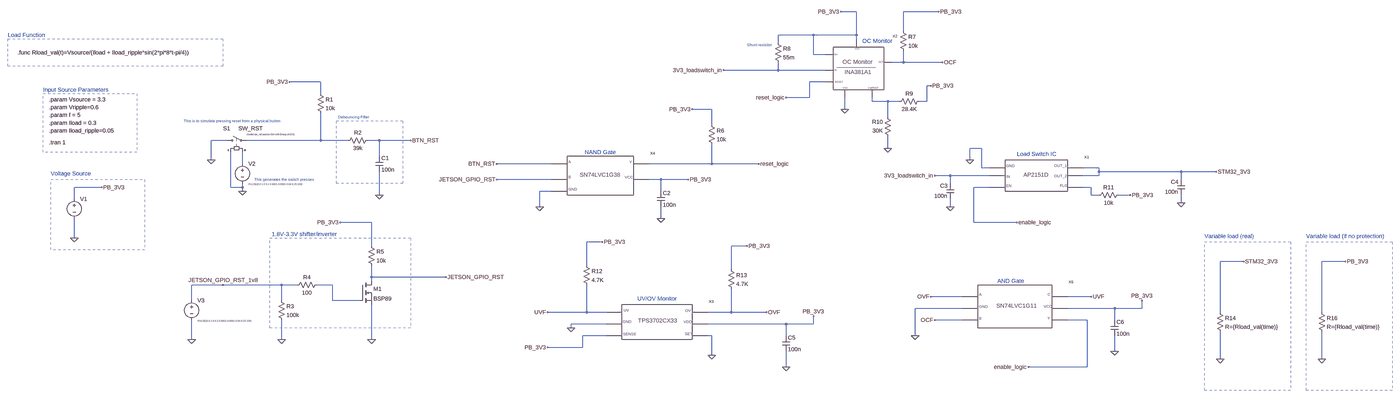
[diagram p0: schematic STM32_PM_Sim.asc, whole sheet]
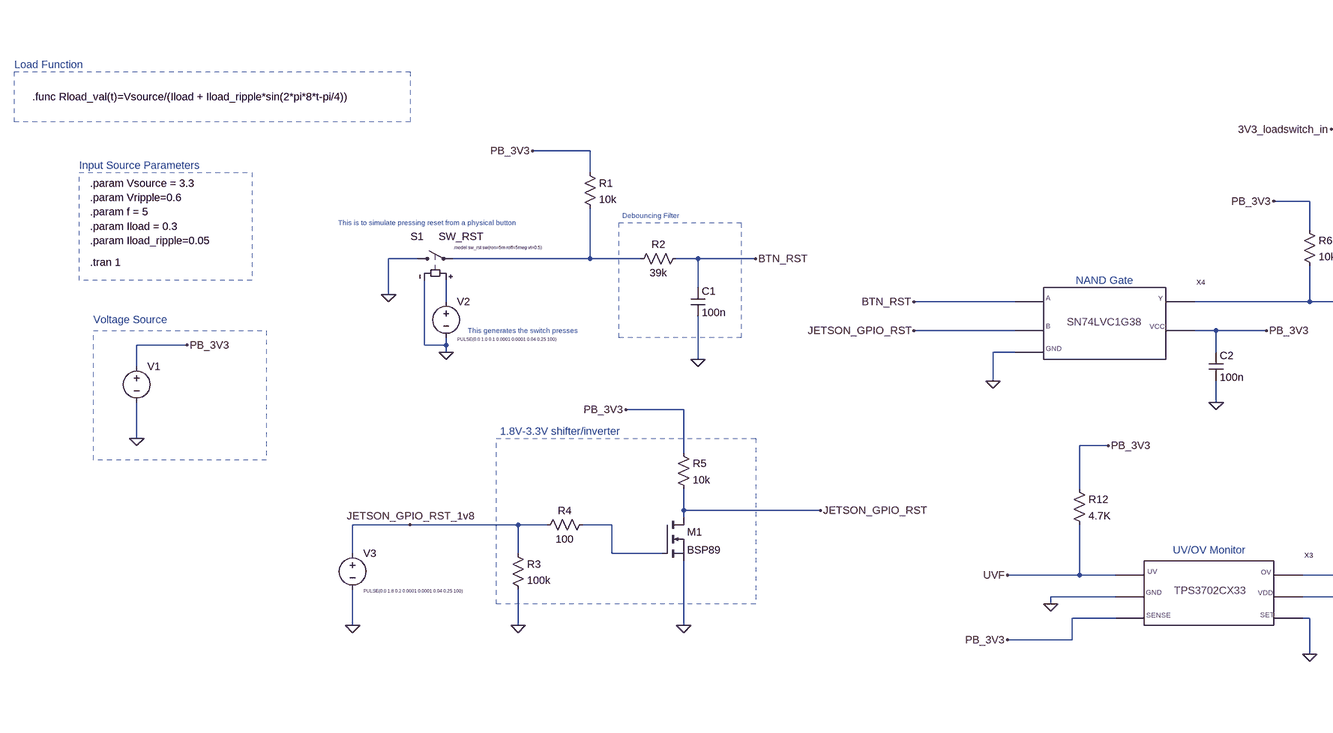
[diagram p1: schematic STM32_PM_Sim.asc, part, row 1 of 1, column 1 of 2]
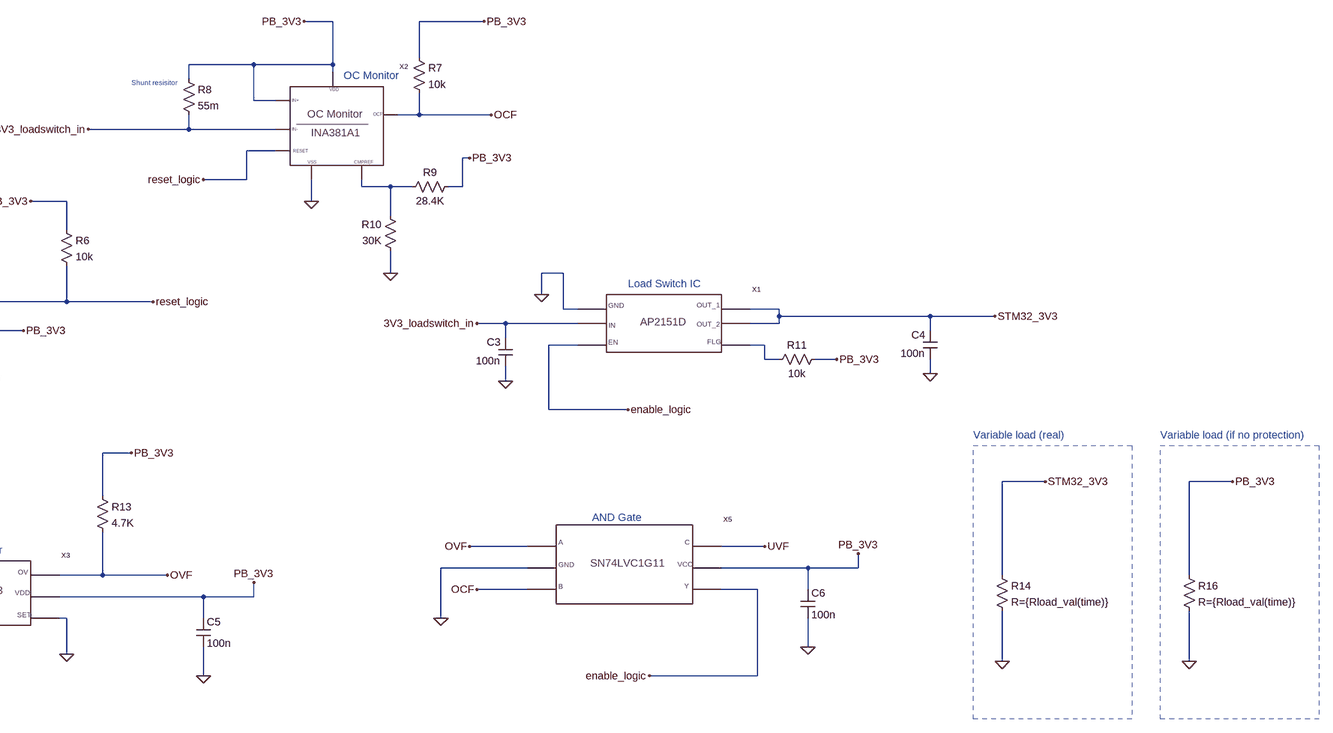
[diagram p2: schematic STM32_PM_Sim.asc, part, row 1 of 1, column 2 of 2]
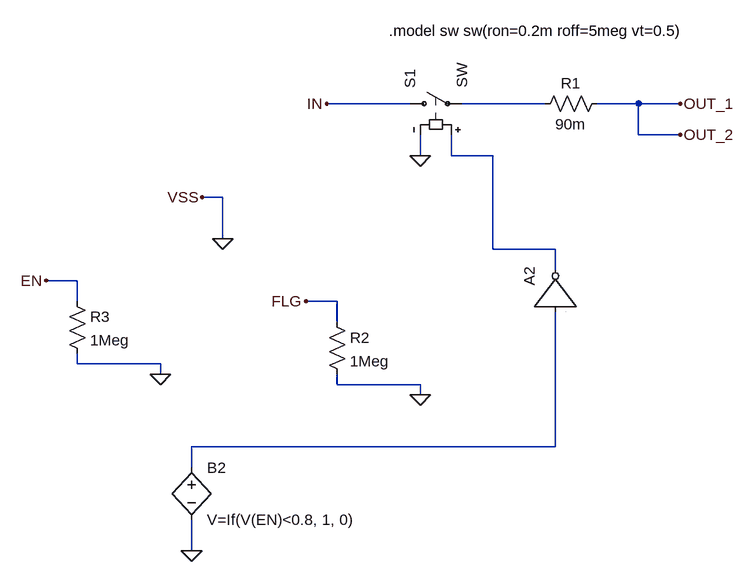
[diagram p3: sub-circuit ap2151d.asc]
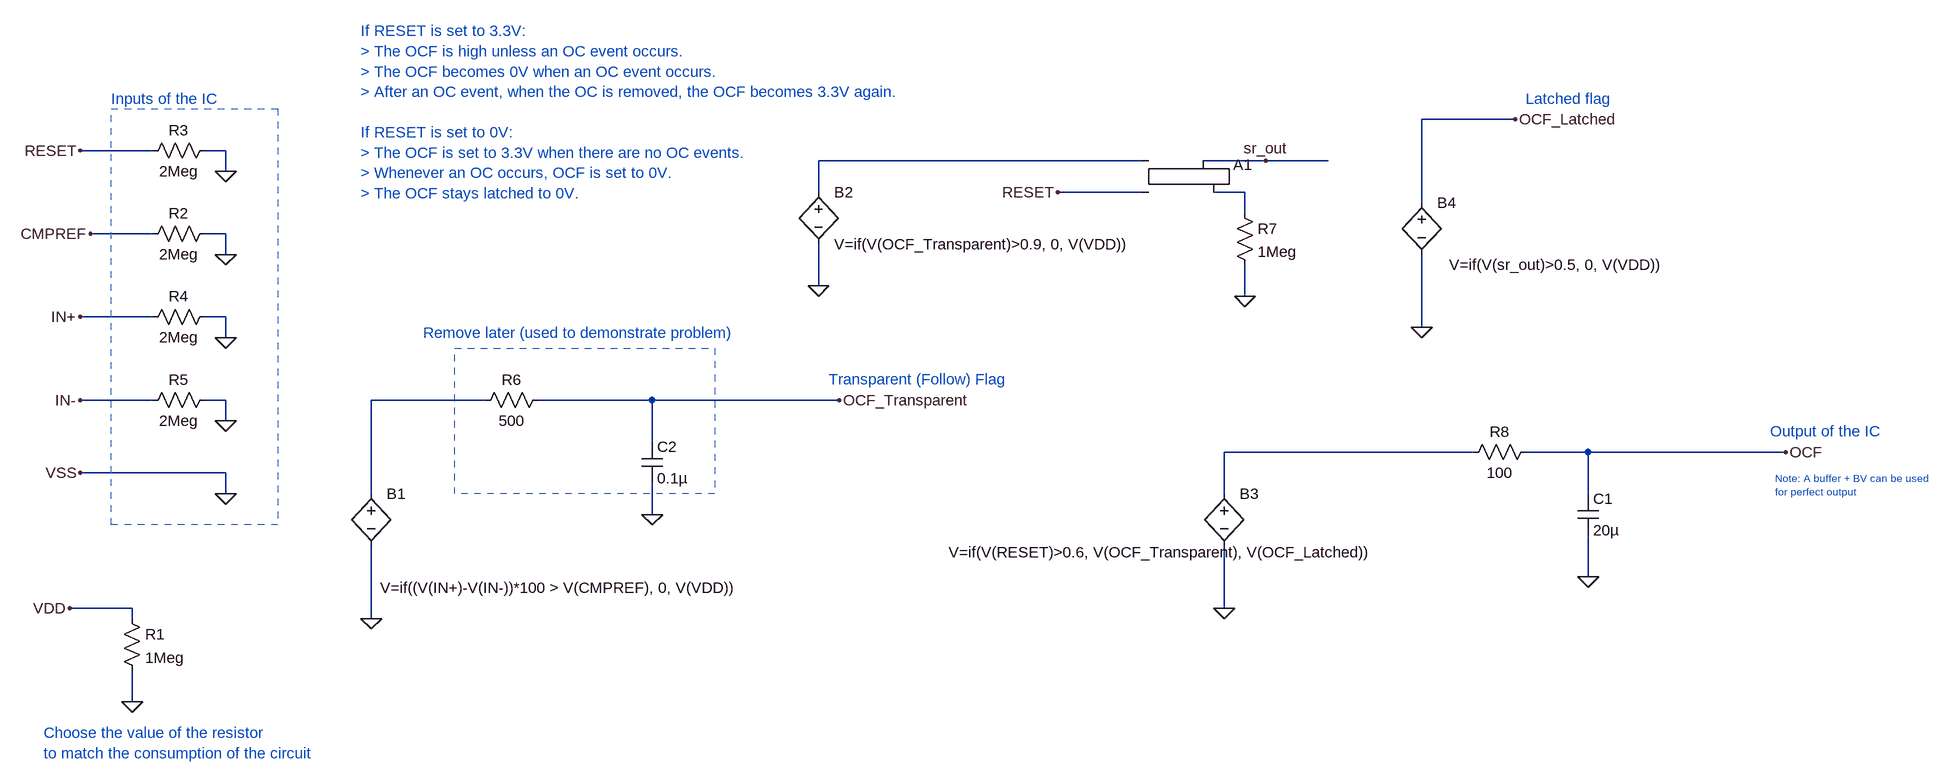
[diagram p4: sub-circuit ina381a1.asc]
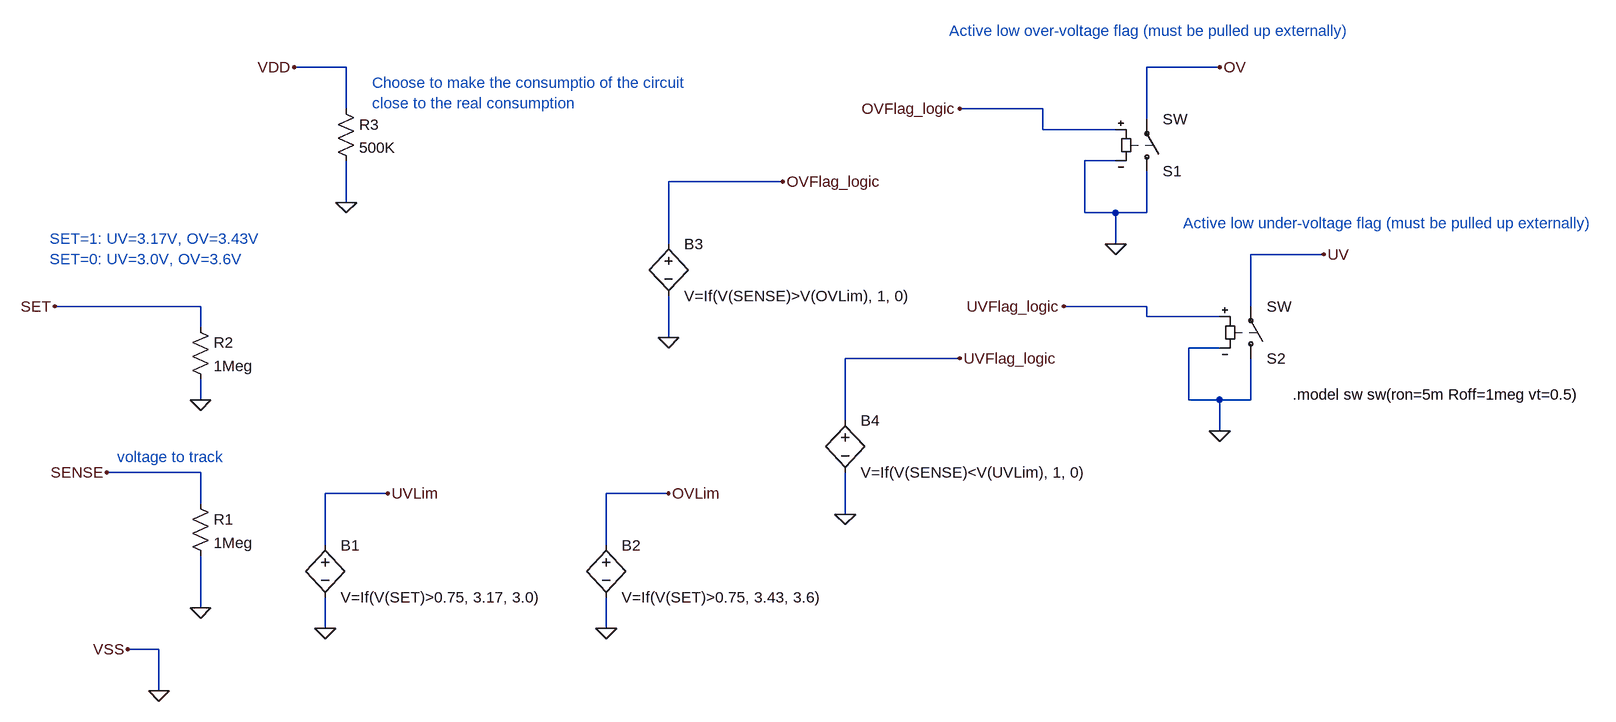
[diagram p5: sub-circuit tps3702cx33ddcr.asc]
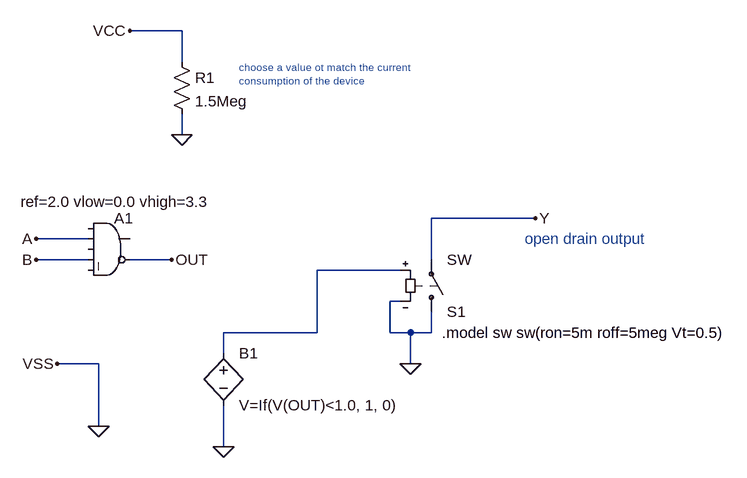
[diagram p6: sub-circuit sn74lvc1g38.asc]
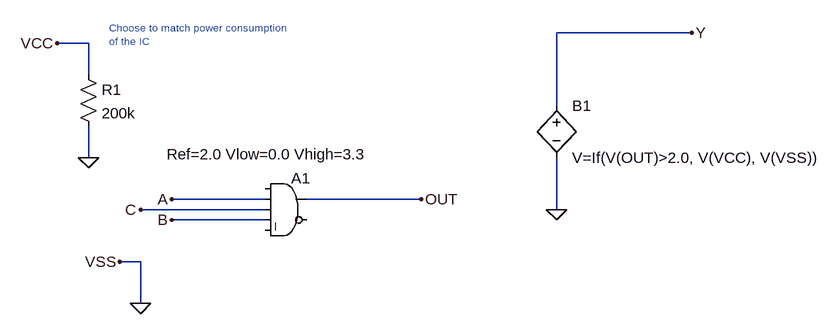
[diagram p7: sub-circuit sn74lvc1g11.asc]
STM32_PM_Sim.asc, the LTspice schematic file:
Version 4
SHEET 1 5784 1092
WIRE 2432 -464 2368 -464
WIRE 2768 -464 2624 -464
WIRE 2624 -384 2624 -464
WIRE 2256 -368 2112 -368
WIRE 2432 -368 2432 -464
WIRE 2432 -368 2256 -368
WIRE 2432 -352 2432 -368
WIRE 2112 -336 2112 -368
WIRE 2256 -288 2256 -368
WIRE 2304 -288 2256 -288
WIRE 2624 -256 2624 -304
WIRE 2624 -256 2576 -256
WIRE 2784 -256 2624 -256
WIRE 2112 -224 2112 -256
WIRE 2112 -224 1888 -224
WIRE 2304 -224 2112 -224
WIRE 240 -176 112 -176
WIRE 2304 -176 2240 -176
WIRE 2736 -160 2720 -160
WIRE 240 -128 240 -176
WIRE 2240 -112 2240 -176
WIRE 2240 -112 2144 -112
WIRE 2496 -96 2496 -112
WIRE 2560 -96 2496 -96
WIRE 2608 -96 2560 -96
WIRE 2720 -96 2720 -160
WIRE 2720 -96 2688 -96
WIRE 1840 -64 1760 -64
WIRE 2384 -64 2384 -112
WIRE 2560 -32 2560 -96
WIRE 1840 0 1840 -64
WIRE -144 64 -208 64
WIRE 240 64 240 -48
WIRE 240 64 -64 64
WIRE 352 64 240 64
WIRE 480 64 432 64
WIRE 608 64 480 64
WIRE 2560 96 2560 48
WIRE 2944 96 2896 96
WIRE 480 128 480 64
WIRE -208 144 -208 64
WIRE 2896 144 2896 96
WIRE -80 160 -80 112
WIRE 1184 160 960 160
WIRE 1840 160 1840 80
WIRE 1840 160 1584 160
WIRE 2032 160 1840 160
WIRE 2944 176 2944 96
WIRE 2976 176 2944 176
WIRE 3424 176 3360 176
WIRE 3424 192 3424 176
WIRE 3760 192 3424 192
WIRE 3904 192 3760 192
WIRE 2816 208 2752 208
WIRE 2976 208 2816 208
WIRE 3424 208 3424 192
WIRE 3424 208 3360 208
WIRE 1184 224 960 224
WIRE 1632 224 1584 224
WIRE 1744 224 1632 224
WIRE 3760 224 3760 192
WIRE 2816 240 2816 208
WIRE -656 256 -768 256
WIRE -128 256 -128 112
WIRE -80 256 -80 240
WIRE -80 256 -128 256
WIRE 2976 256 2912 256
WIRE 3392 256 3360 256
WIRE -80 272 -80 256
WIRE 1184 272 1136 272
WIRE 1632 272 1632 224
WIRE 480 288 480 192
WIRE 3392 288 3392 256
WIRE 3424 288 3392 288
WIRE 3552 288 3504 288
WIRE -768 304 -768 256
WIRE 3760 320 3760 288
WIRE 1136 336 1136 272
WIRE 2816 336 2816 304
WIRE 1632 384 1632 336
WIRE 448 400 320 400
WIRE 2912 400 2912 256
WIRE 3088 400 2912 400
WIRE -768 464 -768 384
WIRE 1392 480 1328 480
WIRE 448 496 448 400
WIRE 1984 496 1920 496
WIRE 4016 560 3920 560
WIRE 4432 560 4336 560
WIRE 1328 576 1328 480
WIRE 1920 592 1920 496
WIRE 448 624 448 576
WIRE 752 624 448 624
WIRE 448 640 448 624
WIRE -160 656 -288 656
WIRE 80 656 -160 656
WIRE 144 656 80 656
WIRE 288 656 224 656
WIRE 2864 704 2736 704
WIRE 3392 704 3296 704
WIRE -288 720 -288 656
WIRE 80 720 80 656
WIRE 288 720 288 656
WIRE 400 720 288 720
WIRE 2864 752 2672 752
WIRE 3488 752 3296 752
WIRE 3600 752 3600 720
WIRE 3600 752 3488 752
WIRE 1328 768 1328 656
WIRE 1328 768 1168 768
WIRE 1408 768 1328 768
WIRE 1920 768 1920 672
WIRE 1920 768 1824 768
WIRE 2064 768 1920 768
WIRE 3920 768 3920 560
WIRE 4336 768 4336 560
WIRE 2864 800 2752 800
WIRE 3376 800 3296 800
WIRE 3488 800 3488 752
WIRE 1408 816 1264 816
WIRE 2144 816 1824 816
WIRE 2256 816 2256 784
WIRE 2256 816 2144 816
WIRE 1264 832 1264 816
WIRE 1408 864 1312 864
WIRE 1840 864 1824 864
WIRE 2144 864 2144 816
WIRE 2672 864 2672 752
WIRE -288 880 -288 800
WIRE 80 880 80 800
WIRE 448 880 448 736
WIRE 1312 912 1312 864
WIRE 1312 912 1168 912
WIRE 3488 928 3488 864
WIRE 1840 944 1840 864
WIRE 3920 960 3920 848
WIRE 4336 960 4336 848
WIRE 2144 992 2144 928
WIRE 3376 992 3376 800
WIRE 3376 992 3136 992
FLAG -656 256 PB_3V3
FLAG -768 464 0
FLAG -80 272 0
FLAG -208 144 0
FLAG 608 64 BTN_RST
FLAG 112 -176 PB_3V3
FLAG 480 288 0
FLAG -288 880 0
FLAG -160 656 JETSON_GPIO_RST_1v8
FLAG 80 880 0
FLAG 320 400 PB_3V3
FLAG 448 880 0
FLAG 752 624 JETSON_GPIO_RST
FLAG 960 160 BTN_RST
FLAG 960 224 JETSON_GPIO_RST
FLAG 1136 336 0
FLAG 1744 224 PB_3V3
FLAG 1632 384 0
FLAG 2032 160 reset_logic
FLAG 1760 -64 PB_3V3
FLAG 2144 -112 reset_logic
FLAG 2384 -64 0
FLAG 2768 -464 PB_3V3
FLAG 2784 -256 OCF
FLAG 2368 -464 PB_3V3
FLAG 1888 -224 3V3_loadswitch_in
FLAG 2560 96 0
FLAG 2736 -160 PB_3V3
FLAG 2752 208 3V3_loadswitch_in
FLAG 2896 144 0
FLAG 3552 288 PB_3V3
FLAG 2816 336 0
FLAG 3760 320 0
FLAG 1264 832 0
FLAG 1168 912 PB_3V3
FLAG 1168 768 UVF
FLAG 1392 480 PB_3V3
FLAG 1984 496 PB_3V3
FLAG 2064 768 OVF
FLAG 2256 784 PB_3V3
FLAG 1840 944 0
FLAG 2144 992 0
FLAG 2752 800 OCF
FLAG 2672 864 0
FLAG 2736 704 OVF
FLAG 3392 704 UVF
FLAG 3600 720 PB_3V3
FLAG 3488 928 0
FLAG 3136 992 enable_logic
FLAG 3088 400 enable_logic
FLAG 4016 560 STM32_3V3
FLAG 3920 960 0
FLAG 4432 560 PB_3V3
FLAG 4336 960 0
FLAG 3904 192 STM32_3V3
SYMBOL AP2151D 3120 208 R0
SYMATTR InstName X1
SYMBOL INA381A1 2496 -224 R0
SYMATTR InstName X2
SYMBOL TPS3702CX33DDCR 1584 800 R0
SYMATTR InstName X3
SYMBOL voltage -768 288 R0
WINDOW 3 24 96 Invisible 2
WINDOW 123 0 0 Left 0
WINDOW 39 0 0 Left 0
SYMATTR Value SINE({Vsource} {Vripple} {f} 0 0 0)
SYMATTR InstName V1
SYMBOL voltage -80 144 R0
WINDOW 3 25 100 Left 0
WINDOW 123 0 0 Left 0
WINDOW 39 0 0 Left 0
SYMATTR Value PULSE(0.0 1.0 0.1 0.0001 0.0001 0.04 0.25 100)
SYMATTR InstName V2
SYMBOL sw -160 64 R270
WINDOW 0 49 1 VRight 2
WINDOW 3 49 63 VRight 2
SYMATTR InstName S1
SYMATTR Value SW_RST
SYMBOL res 224 -144 R0
SYMATTR InstName R1
SYMATTR Value 10k
SYMBOL res 448 48 R90
WINDOW 0 0 56 VBottom 2
WINDOW 3 32 56 VTop 2
SYMATTR InstName R2
SYMATTR Value 39k
SYMBOL cap 464 128 R0
SYMATTR InstName C1
SYMATTR Value 100n
SYMATTR SpiceLine Rser=0.1
SYMBOL voltage -288 704 R0
WINDOW 3 25 100 Left 0
WINDOW 123 0 0 Left 0
WINDOW 39 0 0 Left 0
SYMATTR Value PULSE(0.0 1.8 0.2 0.0001 0.0001 0.04 0.25 100)
SYMATTR InstName V3
SYMBOL res 64 704 R0
SYMATTR InstName R3
SYMATTR Value 100k
SYMBOL res 240 640 R90
WINDOW 0 0 56 VBottom 2
WINDOW 3 32 56 VTop 2
SYMATTR InstName R4
SYMATTR Value 100
SYMBOL nmos 400 640 R0
SYMATTR InstName M1
SYMATTR Value BSP89
SYMBOL res 432 480 R0
SYMATTR InstName R5
SYMATTR Value 10k
SYMBOL SN74LVC1G38 1376 208 R0
SYMATTR InstName X4
SYMBOL cap 1616 272 R0
SYMATTR InstName C2
SYMATTR Value 100n
SYMATTR SpiceLine Irms=0.1
SYMBOL res 1824 -16 R0
SYMATTR InstName R6
SYMATTR Value 10k
SYMBOL res 2608 -400 R0
SYMATTR InstName R7
SYMATTR Value 10k
SYMBOL res 2096 -352 R0
SYMATTR InstName R8
SYMATTR Value 55m
SYMBOL res 2704 -112 R90
WINDOW 0 0 56 VBottom 2
WINDOW 3 32 56 VTop 2
SYMATTR InstName R9
SYMATTR Value 28.4K
SYMBOL res 2576 64 R180
WINDOW 0 36 76 Left 2
WINDOW 3 36 40 Left 2
SYMATTR InstName R10
SYMATTR Value 30K
SYMBOL res 3520 272 R90
WINDOW 0 0 56 VBottom 2
WINDOW 3 32 56 VTop 2
SYMATTR InstName R11
SYMATTR Value 10k
SYMBOL cap 2800 240 R0
WINDOW 0 -26 10 Left 2
WINDOW 3 -50 51 Left 2
SYMATTR InstName C3
SYMATTR Value 100n
SYMATTR SpiceLine Rser=0.1
SYMBOL cap 3744 224 R0
WINDOW 0 -26 10 Left 2
WINDOW 3 -50 51 Left 2
SYMATTR InstName C4
SYMATTR Value 100n
SYMATTR SpiceLine Rser=0.1
SYMBOL res 1312 560 R0
SYMATTR InstName R12
SYMATTR Value 4.7K
SYMBOL res 1904 576 R0
SYMATTR InstName R13
SYMATTR Value 4.7K
SYMBOL cap 2128 864 R0
SYMATTR InstName C5
SYMATTR Value 100n
SYMATTR SpiceLine Rser=0.1
SYMBOL SN74LVC1G11 3040 736 R0
SYMATTR InstName X5
SYMBOL cap 3472 800 R0
SYMATTR InstName C6
SYMATTR Value 100n
SYMATTR SpiceLine Rser=0.1
SYMBOL res 3904 752 R0
SYMATTR InstName R14
SYMATTR Value R={Rload_val(time)}
SYMBOL res 4320 752 R0
SYMATTR InstName R16
SYMATTR Value R={Rload_val(time)}
TEXT -1000 -296 Left 2 !.func Rload_val(t)=Vsource/(Iload + Iload_ripple*sin(2*pi*8*t-pi/4))
TEXT -1040 -368 Left 2 ;Load Function
TEXT -896 -144 Left 2 ;Input Source Parameters
TEXT -872 -104 Left 2 !.param Vsource = 3.3
TEXT -872 -72 Left 2 !.param Vripple=0.6
TEXT -872 -8 Left 2 !.param Iload = 0.3
TEXT -872 24 Left 2 !.param Iload_ripple=0.05
TEXT -872 -40 Left 2 !.param f = 5
TEXT -872 72 Left 2 !.tran 1
TEXT -864 200 Left 2 ;Voltage Source
TEXT -320 -16 Left 1 ;This is to simulate pressing reset from a physical button
TEXT -64 40 Left 0 !.model sw_rst sw(ron=5m roff=5meg vt=0.5)
TEXT -32 224 Left 1 ;This generates the switch presses
TEXT 312 -32 Left 1 ;Debouncing Filter
TEXT 40 448 Left 2 ;1.8V-3.3V shifter/inverter
TEXT 1984 -328 Left 1 ;Shunt resisitor
TEXT 3856 456 Left 2 ;Variable load (real)
TEXT 1536 712 Left 2 ;UV/OV Monitor
TEXT 1320 112 Left 2 ;NAND Gate
TEXT 2456 -344 Left 2 ;OC Monitor
TEXT 3088 120 Left 2 ;Load Switch IC
TEXT 4272 456 Left 2 ;Variable load (if no protection)
TEXT 3008 640 Left 2 ;AND Gate
RECTANGLE Normal -160 -240 -1040 -352 2
RECTANGLE Normal -512 112 -896 -128 2
RECTANGLE Normal -480 512 -864 224 2
RECTANGLE Normal 576 240 304 -16 2
RECTANGLE Normal 608 832 32 464 2
RECTANGLE Normal 4208 1088 3856 480 2
RECTANGLE Normal 4624 1088 4272 480 2

ap2151d.asc, the sub-circuit schematic file:
Version 4
SHEET 1 1112 692
WIRE 320 -32 192 -32
WIRE 528 -32 400 -32
WIRE 672 -32 608 -32
WIRE 736 -32 672 -32
WIRE 672 16 672 -32
WIRE 736 16 672 16
WIRE 336 48 336 16
WIRE 384 48 384 16
WIRE 448 48 384 48
WIRE 32 112 0 112
WIRE 32 176 32 112
WIRE 448 192 448 48
WIRE 544 192 448 192
WIRE 544 224 544 192
WIRE -192 240 -240 240
WIRE -192 272 -192 240
WIRE 208 272 160 272
WIRE 208 304 208 272
WIRE -192 368 -192 352
WIRE -64 368 -192 368
WIRE -64 384 -64 368
WIRE 208 400 208 384
WIRE 336 400 208 400
WIRE 336 416 336 400
WIRE 544 496 544 288
WIRE 544 496 -16 496
WIRE -16 528 -16 496
WIRE -16 656 -16 608
FLAG 0 112 VSS
FLAG 32 176 0
FLAG 336 48 0
FLAG 192 -32 IN
FLAG 736 -32 OUT_1
FLAG 736 16 OUT_2
FLAG -16 656 0
FLAG 160 272 FLG
FLAG 336 416 0
FLAG -240 240 EN
FLAG -64 384 0
SYMBOL sw 304 -32 R270
SYMATTR InstName S1
SYMBOL res 624 -48 R90
WINDOW 0 0 56 VBottom 2
WINDOW 3 32 56 VTop 2
SYMATTR InstName R1
SYMATTR Value 90m
SYMBOL bv -16 512 R0
SYMATTR InstName B2
SYMATTR Value V=If(V(EN)<0.8, 1, 0)
SYMBOL Digital\\inv 480 288 R270
SYMATTR InstName A2
SYMBOL res 192 288 R0
SYMATTR InstName R2
SYMATTR Value 1Meg
SYMBOL res -208 256 R0
SYMATTR InstName R3
SYMATTR Value 1Meg
TEXT 288 -144 Left 2 !.model sw sw(ron=0.2m roff=5meg vt=0.5)

ina381a1.asc, the sub-circuit schematic file:
Version 4
SHEET 1 2840 700
WIRE 1632 -288 1488 -288
WIRE -464 -240 -576 -240
WIRE -352 -240 -384 -240
WIRE 1056 -224 560 -224
WIRE 1248 -224 1152 -224
WIRE 1344 -224 1248 -224
WIRE -352 -208 -352 -240
WIRE 560 -176 560 -224
WIRE 1056 -176 928 -176
WIRE 1216 -176 1168 -176
WIRE 1488 -160 1488 -288
WIRE 1216 -144 1216 -176
WIRE -464 -112 -560 -112
WIRE -352 -112 -384 -112
WIRE -352 -80 -352 -112
WIRE 560 -32 560 -96
WIRE 1216 -16 1216 -64
WIRE -464 16 -576 16
WIRE -352 16 -384 16
WIRE 1488 32 1488 -80
WIRE -352 48 -352 16
WIRE -464 144 -576 144
WIRE -352 144 -384 144
WIRE 48 144 -128 144
WIRE 304 144 128 144
WIRE 592 144 304 144
WIRE -352 176 -352 144
WIRE 304 208 304 144
WIRE 1568 224 1184 224
WIRE 1744 224 1648 224
WIRE 2048 224 1744 224
WIRE -352 256 -576 256
WIRE -352 288 -352 256
WIRE -128 288 -128 144
WIRE 1184 288 1184 224
WIRE 1744 288 1744 224
WIRE 304 320 304 272
WIRE 1744 416 1744 352
WIRE -496 464 -592 464
WIRE 1184 464 1184 368
WIRE -496 480 -496 464
WIRE -128 480 -128 368
WIRE -496 608 -496 560
FLAG -560 -112 CMPREF
FLAG -576 256 VSS
FLAG 592 144 OCF_Transparent
FLAG -576 16 IN+
FLAG -576 144 IN-
FLAG -128 480 0
FLAG -352 -80 0
FLAG -352 288 0
FLAG -352 48 0
FLAG -352 176 0
FLAG -576 -240 RESET
FLAG -352 -208 0
FLAG 560 -32 0
FLAG 928 -176 RESET
FLAG 1184 464 0
FLAG 1216 -16 0
FLAG 2048 224 OCF
FLAG 1248 -224 sr_out
FLAG 1488 32 0
FLAG 1632 -288 OCF_Latched
FLAG -592 464 VDD
FLAG -496 608 0
FLAG 1744 416 0
FLAG 304 320 0
SYMBOL bv -128 272 R0
WINDOW 3 14 161 Left 2
SYMATTR Value V=if((V(IN+)-V(IN-))*100 > V(CMPREF), 0, V(VDD))
SYMATTR InstName B1
SYMBOL res -368 -128 R90
WINDOW 0 0 56 VBottom 2
WINDOW 3 32 56 VTop 2
SYMATTR InstName R2
SYMATTR Value 2Meg
SYMBOL res -368 0 R90
WINDOW 0 0 56 VBottom 2
WINDOW 3 32 56 VTop 2
SYMATTR InstName R4
SYMATTR Value 2Meg
SYMBOL res -368 128 R90
WINDOW 0 0 56 VBottom 2
WINDOW 3 32 56 VTop 2
SYMATTR InstName R5
SYMATTR Value 2Meg
SYMBOL res -368 -256 R90
WINDOW 0 0 56 VBottom 2
WINDOW 3 32 56 VTop 2
SYMATTR InstName R3
SYMATTR Value 2Meg
SYMBOL bv 560 -192 R0
SYMATTR InstName B2
SYMATTR Value V=if(V(OCF_Transparent)>0.9, 0, V(VDD))
SYMBOL Digital\\srflop 1104 -272 R0
SYMATTR InstName A1
SYMBOL bv 1184 272 R0
WINDOW 3 -424 106 Left 2
SYMATTR Value V=if(V(RESET)>0.6, V(OCF_Transparent), V(OCF_Latched))
SYMATTR InstName B3
SYMBOL res 1200 -160 R0
SYMATTR InstName R7
SYMATTR Value 1Meg
SYMBOL res 1664 208 R90
WINDOW 0 0 56 VBottom 2
WINDOW 3 32 56 VTop 2
SYMATTR InstName R8
SYMATTR Value 100
SYMBOL bv 1488 -176 R0
WINDOW 3 42 112 Left 2
SYMATTR Value V=if(V(sr_out)>0.5, 0, V(VDD))
SYMATTR InstName B4
SYMBOL res -512 464 R0
SYMATTR InstName R1
SYMATTR Value 1Meg
SYMBOL cap 1728 288 R0
SYMATTR InstName C1
SYMATTR Value 20µ
SYMATTR SpiceLine Rser=0 Rpar=0
SYMBOL res 144 128 R90
WINDOW 0 0 56 VBottom 2
WINDOW 3 32 56 VTop 2
SYMATTR InstName R6
SYMATTR Value 500
SYMBOL cap 288 208 R0
SYMATTR InstName C2
SYMATTR Value 0.1µ
TEXT -144 -424 Left 2 ;If RESET is set to 3.3V:\n> The OCF is high unless an OC event occurs.\n> The OCF becomes 0V when an OC event occurs.\n> After an OC event, when the OC is removed, the OCF becomes 3.3V again.\n \nIf RESET is set to 0V:\n> The OCF is set to 3.3V when there are no OC events.\n> Whenever an OC occurs, OCF is set to 0V.\n> The OCF stays latched to 0V.
TEXT -528 -320 Left 2 ;Inputs of the IC
TEXT 1648 -320 Left 2 ;Latched flag
TEXT 576 112 Left 2 ;Transparent (Follow) Flag
TEXT 2024 192 Left 2 ;Output of the IC
TEXT 2032 264 Left 1 ;Note: A buffer + BV can be used \nfor perfect output
TEXT -632 656 Left 2 ;Choose the value of the resistor\nto match the consumption of the circuit
TEXT -48 40 Left 2 ;Remove later (used to demonstrate problem)
RECTANGLE Normal -272 336 -528 -304 2
RECTANGLE Normal 400 288 0 64 2

tps3702cx33ddcr.asc, the sub-circuit schematic file:
Version 4
SHEET 1 2456 680
WIRE 464 -448 384 -448
WIRE 1808 -448 1696 -448
WIRE 464 -384 464 -448
WIRE 1536 -384 1408 -384
WIRE 1696 -368 1696 -448
WIRE 1536 -352 1536 -384
WIRE 1648 -352 1536 -352
WIRE 1648 -304 1600 -304
WIRE 1136 -272 960 -272
WIRE 464 -240 464 -304
WIRE 1600 -224 1600 -304
WIRE 1648 -224 1600 -224
WIRE 1696 -224 1696 -288
WIRE 1696 -224 1648 -224
WIRE 960 -176 960 -272
WIRE 1648 -176 1648 -224
WIRE 1968 -160 1856 -160
WIRE 240 -80 16 -80
WIRE 1696 -80 1568 -80
WIRE 1856 -80 1856 -160
WIRE 1696 -64 1696 -80
WIRE 1808 -64 1696 -64
WIRE 240 -48 240 -80
WIRE 960 -32 960 -96
WIRE 1808 -16 1760 -16
WIRE 1408 0 1232 0
WIRE 240 64 240 32
WIRE 1760 64 1760 -16
WIRE 1808 64 1760 64
WIRE 1856 64 1856 0
WIRE 1856 64 1808 64
WIRE 1232 96 1232 0
WIRE 1808 112 1808 64
WIRE 240 176 96 176
WIRE 528 208 432 208
WIRE 960 208 864 208
WIRE 240 224 240 176
WIRE 1232 240 1232 176
WIRE 432 288 432 208
WIRE 864 288 864 208
WIRE 240 384 240 304
WIRE 432 416 432 368
WIRE 864 416 864 368
WIRE 176 448 128 448
WIRE 176 512 176 448
FLAG 96 176 SENSE
FLAG 240 384 0
FLAG 432 416 0
FLAG 16 -80 SET
FLAG 240 64 0
FLAG 528 208 UVLim
FLAG 864 416 0
FLAG 960 208 OVLim
FLAG 960 -32 0
FLAG 1136 -272 OVFlag_logic
FLAG 1232 240 0
FLAG 1408 0 UVFlag_logic
FLAG 1648 -176 0
FLAG 1808 -448 OV
FLAG 1808 112 0
FLAG 1968 -160 UV
FLAG 1408 -384 OVFlag_logic
FLAG 1568 -80 UVFlag_logic
FLAG 384 -448 VDD
FLAG 464 -240 0
FLAG 128 448 VSS
FLAG 176 512 0
SYMBOL res 224 208 R0
SYMATTR InstName R1
SYMATTR Value 1Meg
SYMBOL bv 432 272 R0
SYMATTR InstName B1
SYMATTR Value V=If(V(SET)>0.75, 3.17, 3.0)
SYMBOL res 224 -64 R0
SYMATTR InstName R2
SYMATTR Value 1Meg
SYMBOL bv 864 272 R0
SYMATTR InstName B2
SYMATTR Value V=If(V(SET)>0.75, 3.43, 3.6)
SYMBOL bv 960 -192 R0
SYMATTR InstName B3
SYMATTR Value V=If(V(SENSE)>V(OVLim), 1, 0)
SYMBOL bv 1232 80 R0
SYMATTR InstName B4
SYMATTR Value V=If(V(SENSE)<V(UVLim), 1, 0)
SYMBOL sw 1696 -272 M180
SYMATTR InstName S1
SYMBOL sw 1856 16 M180
SYMATTR InstName S2
SYMBOL res 448 -400 R0
SYMATTR InstName R3
SYMATTR Value 500K
TEXT 112 152 Left 2 ;voltage to track
TEXT 8 -184 Left 2 ;SET=1: UV=3.17V, OV=3.43V\nSET=0: UV=3.0V, OV=3.6V
TEXT 504 -424 Left 2 ;Choose to make the consumptio of the circuit\nclose to the real consumption
TEXT 1392 -504 Left 2 ;Active low over-voltage flag (must be pulled up externally)
TEXT 1752 -208 Left 2 ;Active low under-voltage flag (must be pulled up externally)
TEXT 1920 56 Left 2 !.model sw sw(ron=5m Roff=1meg vt=0.5)

sn74lvc1g38.asc, the sub-circuit schematic file:
Version 4
SHEET 1 1164 680
WIRE 272 -176 192 -176
WIRE 272 -128 272 -176
WIRE 272 -16 272 -48
WIRE 816 112 656 112
WIRE 128 144 48 144
WIRE 128 176 48 176
WIRE 256 176 192 176
WIRE 656 176 656 112
WIRE 608 192 480 192
WIRE 608 240 592 240
WIRE 480 288 480 192
WIRE 480 288 336 288
WIRE 592 288 592 240
WIRE 624 288 592 288
WIRE 656 288 656 256
WIRE 656 288 624 288
WIRE 336 320 336 288
WIRE 144 336 80 336
WIRE 624 336 624 288
WIRE 144 432 144 336
WIRE 336 464 336 400
FLAG 48 144 A
FLAG 48 176 B
FLAG 624 336 0
FLAG 336 464 0
FLAG 192 -176 VCC
FLAG 272 -16 0
FLAG 80 336 VSS
FLAG 144 432 0
FLAG 816 112 Y
FLAG 256 176 OUT
SYMBOL Digital\\and 160 96 R0
WINDOW 39 -136 -9 Left 2
SYMATTR SpiceLine ref=2.0 vlow=0.0 vhigh=3.3
SYMATTR InstName A1
SYMBOL sw 656 272 M180
SYMATTR InstName S1
SYMBOL bv 336 304 R0
SYMATTR InstName B1
SYMATTR Value V=If(V(OUT)<1.0, 1, 0)
SYMBOL res 256 -144 R0
SYMATTR InstName R1
SYMATTR Value 1.5Meg
TEXT 672 288 Left 2 !.model sw sw(ron=5m roff=5meg Vt=0.5)
TEXT 800 144 Left 2 ;open drain output
TEXT 360 -120 Left 1 ;choose a value ot match the current\nconsumption of the device

sn74lvc1g11.asc, the sub-circuit schematic file:
Version 4
SHEET 1 1040 680
WIRE 816 -112 608 -112
WIRE -112 -96 -160 -96
WIRE -112 -48 -112 -96
WIRE 608 0 608 -112
WIRE -112 80 -112 32
WIRE 160 144 16 144
WIRE 400 144 224 144
WIRE 160 160 -32 160
WIRE 608 160 608 80
WIRE 160 176 16 176
WIRE -32 240 -64 240
WIRE -32 304 -32 240
FLAG 16 144 A
FLAG 16 176 B
FLAG -64 240 VSS
FLAG -32 304 0
FLAG 400 144 OUT
FLAG -160 -96 VCC
FLAG -32 160 C
FLAG -112 80 0
FLAG 608 160 0
FLAG 816 -112 Y
SYMBOL Digital\\and 192 96 R0
WINDOW 39 -184 -21 Left 2
SYMATTR InstName A1
SYMATTR SpiceLine Ref=2.0 Vlow=0.0 Vhigh=3.3
SYMBOL res -128 -64 R0
SYMATTR InstName R1
SYMATTR Value 200k
SYMBOL bv 608 -16 R0
SYMATTR InstName B1
SYMATTR Value V=If(V(OUT)>2.0, V(VCC), V(VSS))
TEXT -80 -120 Left 1 ;Choose to match power consumption\nof the IC

The netlist it stands for:
* STM32_PM_Sim.asc
XX1 0 3V3_loadswitch_in enable_logic STM32_3V3 STM32_3V3 N004 ap2151d
XX2 PB_3V3 3V3_loadswitch_in 0 N001 PB_3V3 OCF reset_logic ina381a1
XX3 UVF 0 PB_3V3 OVF PB_3V3 0 tps3702cx33ddcr
V1 PB_3V3 0 SINE({Vsource} {Vripple} {f} 0 0 0)
V2 N003 0 PULSE(0.0 1.0 0.1 0.0001 0.0001 0.04 0.25 100)
S1 0 N002 N003 0 SW_RST
R1 PB_3V3 N002 10k
R2 BTN_RST N002 39k
C1 BTN_RST 0 100n Rser=0.1
V3 JETSON_GPIO_RST_1v8 0 PULSE(0.0 1.8 0.2 0.0001 0.0001 0.04 0.25 100)
R3 JETSON_GPIO_RST_1v8 0 100k
R4 N005 JETSON_GPIO_RST_1v8 100
M1 JETSON_GPIO_RST N005 0 0 BSP89
R5 PB_3V3 JETSON_GPIO_RST 10k
XX4 BTN_RST JETSON_GPIO_RST 0 reset_logic PB_3V3 sn74lvc1g38
C2 PB_3V3 0 100n Irms=0.1
R6 PB_3V3 reset_logic 10k
R7 PB_3V3 OCF 10k
R8 PB_3V3 3V3_loadswitch_in 55m
R9 PB_3V3 N001 28.4K
R10 0 N001 30K
R11 PB_3V3 N004 10k
C3 3V3_loadswitch_in 0 100n Rser=0.1
C4 STM32_3V3 0 100n Rser=0.1
R12 PB_3V3 UVF 4.7K
R13 PB_3V3 OVF 4.7K
C5 PB_3V3 0 100n Rser=0.1
XX5 OVF 0 OCF UVF PB_3V3 enable_logic sn74lvc1g11
C6 PB_3V3 0 100n Rser=0.1
R14 STM32_3V3 0 R={Rload_val(time)}
R16 PB_3V3 0 R={Rload_val(time)}

* block symbol definitions
.subckt ap2151d VSS IN EN OUT_1 OUT_1 FLG
S1 IN N001 N002 0 SW
R1 OUT_1 N001 90m
B2 N003 0 V=If(V(EN)<0.8, 1, 0)
A2 N003 0 0 0 0 N002 0 0 BUF
R2 FLG 0 1Meg
R3 EN 0 1Meg
.model sw sw(ron=0.2m roff=5meg vt=0.5)
.ends ap2151d

.subckt ina381a1 IN+ IN- VSS CMPREF VDD OCF RESET
B1 N003 0 V=if((V(IN+)-V(IN-))*100 > V(CMPREF), 0, V(VDD))
R2 0 CMPREF 2Meg
R4 0 IN+ 2Meg
R5 0 IN- 2Meg
R3 0 RESET 2Meg
B2 N001 0 V=if(V(OCF_Transparent)>0.9, 0, V(VDD))
A1 N001 RESET 0 0 0 N002 sr_out 0 SRFLOP
B3 N004 0 V=if(V(RESET)>0.6, V(OCF_Transparent), V(OCF_Latched))
R7 N002 0 1Meg
R8 OCF N004 100
B4 OCF_Latched 0 V=if(V(sr_out)>0.5, 0, V(VDD))
R1 VDD 0 1Meg
C1 OCF 0 20µ Rser=0 Rpar=0
R6 OCF_Transparent N003 500
C2 OCF_Transparent 0 0.1µ
* If RESET is set to 3.3V:
* > The OCF is high unless an OC event occurs.
* > The OCF becomes 0V when an OC event occurs.
* > After an OC event, when the OC is removed, the OCF becomes 3.3V again.
* If RESET is set to 0V:
* > The OCF is set to 3.3V when there are no OC events.
* > Whenever an OC occurs, OCF is set to 0V.
* > The OCF stays latched to 0V.
* Inputs of the IC
* Latched flag
* Transparent (Follow) Flag
* Output of the IC
* Note: A buffer + BV can be used
* for perfect output
* Choose the value of the resistor
* to match the consumption of the circuit
* Remove later (used to demonstrate problem)
.ends ina381a1

.subckt tps3702cx33ddcr UV VSS SENSE OV VDD SET
R1 SENSE 0 1Meg
B1 UVLim 0 V=If(V(SET)>0.75, 3.17, 3.0)
R2 SET 0 1Meg
B2 OVLim 0 V=If(V(SET)>0.75, 3.43, 3.6)
B3 OVFlag_logic 0 V=If(V(SENSE)>V(OVLim), 1, 0)
B4 UVFlag_logic 0 V=If(V(SENSE)<V(UVLim), 1, 0)
S1 0 OV OVFlag_logic 0 SW
S2 0 UV UVFlag_logic 0 SW
R3 VDD 0 500K
* voltage to track
* SET=1: UV=3.17V, OV=3.43V
* SET=0: UV=3.0V, OV=3.6V
* Choose to make the consumptio of the circuit
* close to the real consumption
* Active low over-voltage flag (must be pulled up externally)
* Active low under-voltage flag (must be pulled up externally)
.model sw sw(ron=5m Roff=1meg vt=0.5)
.ends tps3702cx33ddcr

.subckt sn74lvc1g38 A B VSS Y VCC
A1 0 A 0 B 0 OUT 0 0 AND ref=2.0 vlow=0.0 vhigh=3.3
S1 0 Y N001 0 SW
B1 N001 0 V=If(V(OUT)<1.0, 1, 0)
R1 VCC 0 1.5Meg
.model sw sw(ron=5m roff=5meg Vt=0.5)
* open drain output
* choose a value ot match the current
* consumption of the device
.ends sn74lvc1g38

.subckt sn74lvc1g11 A VSS B C VCC Y
A1 0 A C B 0 0 OUT 0 AND Ref=2.0 Vlow=0.0 Vhigh=3.3
R1 VCC 0 200k
B1 Y 0 V=If(V(OUT)>2.0, V(VCC), V(VSS))
* Choose to match power consumption
* of the IC
.ends sn74lvc1g11

.model NMOS NMOS
.model PMOS PMOS
.lib standard.mos
.func Rload_val(t)=Vsource/(Iload + Iload_ripple*sin(2*pi*8*t-pi/4))
* Load Function
* Input Source Parameters
.param Vsource = 3.3
.param Vripple=0.6
.param Iload = 0.3
.param Iload_ripple=0.05
.param f = 5
.tran 1
* Voltage Source
* This is to simulate pressing reset from a physical button
.model sw_rst sw(ron=5m roff=5meg vt=0.5)
* This generates the switch presses
* Debouncing Filter
* 1.8V-3.3V shifter/inverter
* Shunt resisitor
* Variable load (real)
* UV/OV Monitor
* NAND Gate
* OC Monitor
* Load Switch IC
* Variable load (if no protection)
* AND Gate
.backanno
.end